# Altium project Oximeter_Board.PrjPcb
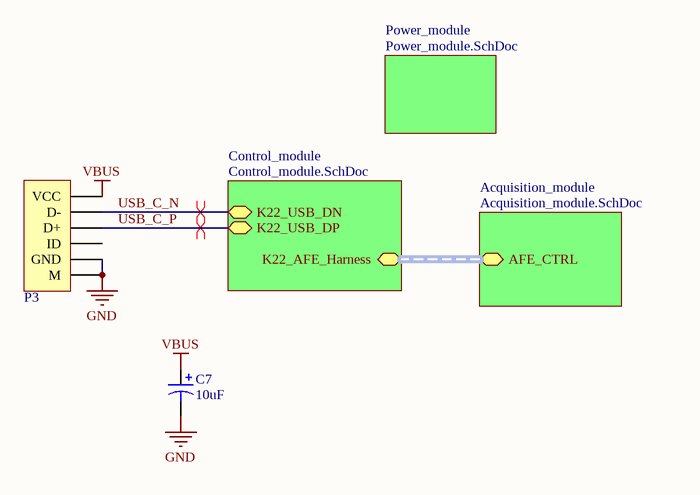
[diagram p0: Main.SchDoc]
3 sheets, 40 parts. Net scope: hierarchical (ports join the sheet entries above them; power ports are global).
Board file: PCB.PcbDoc
Sheets:
  Main.SchDoc
    Control_module = Control_module.SchDoc
    Acquisition_module = Acquisition_module.SchDoc

## Sheet Main.SchDoc
size A4

### Parts
C7  value 10uF  [CAP SMD 4mm]  (hidden comment: Cap Pol1)
P3  USB Header  [MicroUSB-B]  (value not drawn)

### Sub-sheets
Acquisition_module = Acquisition_module.SchDoc: AFE_CTRL (harness AFE_Harness)
Control_module = Control_module.SchDoc: K22_AFE_Harness (harness AFE_Harness), K22_USB_DP (bidir), K22_USB_DN (bidir)
Power_module = Power_module.SchDoc (file not in this document): no entries

### Nets
GND: C7.2 P3.GND P3.M
VBUS: C7.1 P3.VCC
USB_C_N: P3.D- ; sheet Control_module/K22_USB_DN
USB_C_P: P3.D+ ; sheet Control_module/K22_USB_DP

Not connected (* = marked no-connect by the designer): P3 ID

### Buses and harness runs
harness sheet Acquisition_module/AFE_CTRL = sheet Control_module/K22_AFE_Harness

### Layout directives
differential pair: USB_C_N, USB_C_P

### Library data of the parts
C7 = Cap Pol1: Polarized Capacitor (Radial); Published: 8-Jun-2000; LatestRevisionDate: 17-Jul-2002; LatestRevisionNote: Re-released for DXP Platform.; PackageReference: RB7.6-15; Publisher: Altium Limited; PackageDescription: Polarized Capacitor (Radial); 2 Leads
P3 = USB 7 pin Header: LatestRevisionDate: 17-Jul-2002; LatestRevisionNote: Re-released for DXP Platform.; Publisher: Altium Limited

## Sheet Control_module.SchDoc
size A4
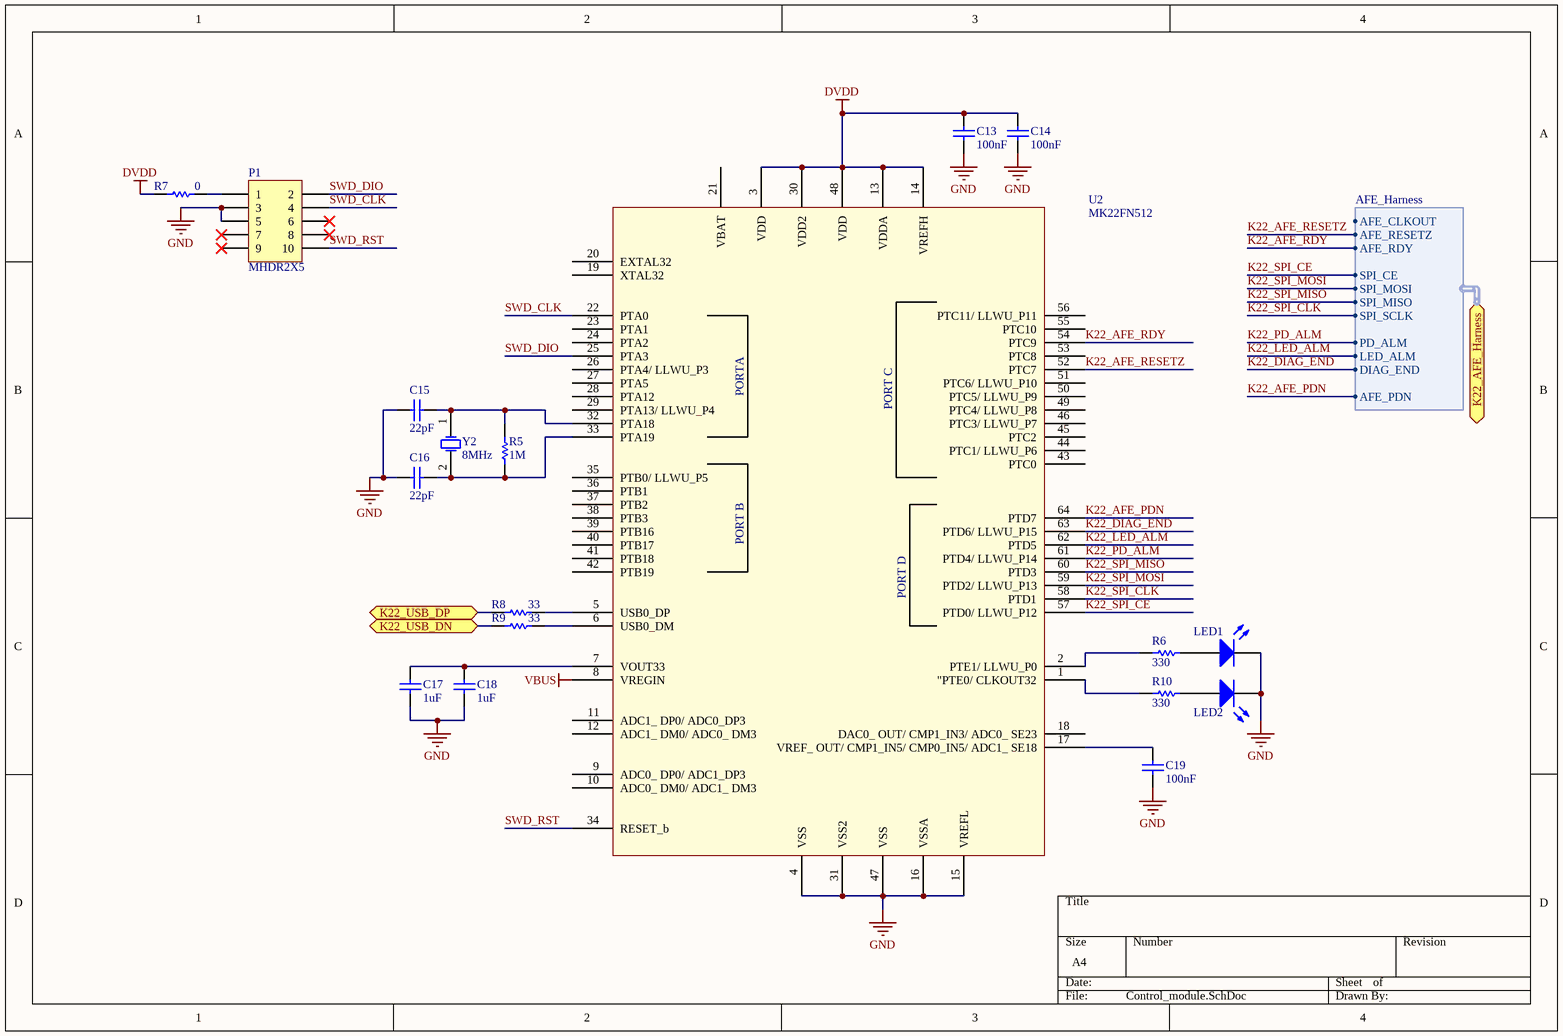
[diagram p1: Control_module.SchDoc]

### Parts
C13  value 100nF  [6-0805_M]  (hidden comment: Cap)
C14  value 100nF  [6-0805_M]  (hidden comment: Cap)
C15  value 22pF  [6-0805_M]  (hidden comment: Cap)
C16  value 22pF  [6-0805_M]  (hidden comment: Cap)
C17  value 1uF  [6-0805_M]  (hidden comment: Cap)
C18  value 1uF  [6-0805_M]  (hidden comment: Cap)
C19  value 100nF  [6-0805_M]  (hidden comment: Cap)
LED1  LED0  [6-0805_M]  (value not drawn)
LED2  LED0  [6-0805_M]  (value not drawn)
P1  MHDR2X5  [MHDR2X5]
R5  value 1M  [6-0805_M]  (hidden comment: Res1)
R6  value 330  [6-0805_M]  (hidden comment: Res1)
R7  value 0  [6-0805_M]  (hidden comment: Res1)
R8  value 33  [6-0805_M]  (hidden comment: Res1)
R9  value 33  [6-0805_M]  (hidden comment: Res1)
R10  value 330  [6-0805_M]  (hidden comment: Res1)
U2  MK22FN512  [MK22FN512_TSQFP50P1200X1200X160-64N]
Y2  8MHz  [Crystal SMD]

### Ports
K22_AFE_Harness (harness AFE_Harness), K22_USB_DN (bidir), K22_USB_DP (bidir)

### Harnesses
AFE_Harness: AFE_CLKOUT, AFE_RESETZ, AFE_RDY, SPI_CE, SPI_MOSI, SPI_MISO, SPI_SCLK, PD_ALM, LED_ALM, DIAG_END, AFE_PDN

### Nets
DVDD: C13.1 C14.1 R7.1 U2.3(VDD) U2.13(VDDA) U2.14(VREFH) U2.30(VDD2) U2.48(VDD)
GND: C13.2 C14.2 C15.1 C16.1 C17.1 C18.1 C19.1 LED1.2(K) LED2.2(K) P1.3 P1.5 U2.4(VSS) U2.15(VREFL) U2.16(VSSA) U2.31(VSS2) U2.47(VSS)
VBUS: U2.8(VREGIN)
K22_AFE_PDN: U2.64(PTD7) ; port K22_AFE_Harness.AFE_PDN  [project net AFE_PDN]
K22_AFE_RDY: U2.54(PTC9) ; port K22_AFE_Harness.AFE_RDY
K22_AFE_RESETZ: U2.52(PTC7) ; port K22_AFE_Harness.AFE_RESETZ
K22_DIAG_END: U2.63(PTD6/_LLWU_P15) ; port K22_AFE_Harness.DIAG_END
K22_LED_ALM: U2.62(PTD5) ; port K22_AFE_Harness.LED_ALM
K22_PD_ALM: U2.61(PTD4/_LLWU_P14) ; port K22_AFE_Harness.PD_ALM
K22_SPI_CE: U2.57(PTD0/_LLWU_P12) ; port K22_AFE_Harness.SPI_CE
K22_SPI_CLK: U2.58(PTD1) ; port K22_AFE_Harness.SPI_SCLK
K22_SPI_MISO: U2.60(PTD3) ; port K22_AFE_Harness.SPI_MISO
K22_SPI_MOSI: U2.59(PTD2/_LLWU_P13) ; port K22_AFE_Harness.SPI_MOSI
SWD_CLK: P1.4 U2.22(PTA0)
SWD_DIO: P1.2 U2.25(PTA3)
SWD_RST: P1.10 U2.34(RESET_b)
USB_C_N: R9.1 ; port K22_USB_DN
USB_C_P: R8.1 ; port K22_USB_DP
NetC15_2: C15.2 R5.1 U2.32(PTA18) Y2.1(OSC1)
NetC16_2: C16.2 R5.2 U2.33(PTA19) Y2.2(OSC2)
NetC17_2: C17.2 C18.2 U2.7(VOUT33)
NetC19_2: C19.2 U2.17(VREF__OUT/_CMP1_IN5/_CMP0_IN5/_ADC1__SE18)
NetLED1_1: LED1.1(A) R6.2
NetLED2_1: LED2.1(A) R10.2
NetP1_1: P1.1 R7.2
NetR6_1: R6.1 U2.2(PTE1/_LLWU_P0)
NetR8_2: R8.2 U2.5(USB0_DP)
NetR9_2: R9.2 U2.6(USB0_DM)
NetR10_1: R10.1 U2.1("PTE0/_CLKOUT32)

Not connected (* = marked no-connect by the designer): P1 6* 7* 8* 9*; U2 9(ADC0__DP0/_ADC1_DP3) 10(ADC0__DM0/_ADC1__DM3) 11(ADC1__DP0/_ADC0_DP3) 12(ADC1__DM0/_ADC0__DM3) 18(DAC0__OUT/_CMP1_IN3/_ADC0__SE23) 19(XTAL32) 20(EXTAL32) 21(VBAT) 23(PTA1) 24(PTA2) 26(PTA4/_LLWU_P3) 27(PTA5) 28(PTA12) 29(PTA13/_LLWU_P4) 35(PTB0/_LLWU_P5) 36(PTB1) 37(PTB2) 38(PTB3) 39(PTB16) 40(PTB17) 41(PTB18) 42(PTB19) 43(PTC0) 44(PTC1/_LLWU_P6) 45(PTC2) 46(PTC3/_LLWU_P7) 49(PTC4/_LLWU_P8) 50(PTC5/_LLWU_P9) 51(PTC6/_LLWU_P10) 53(PTC8) 55(PTC10) 56(PTC11/_LLWU_P11)

### Notes on the sheet
- (in symbol MK22FN512) PORTA; PORT C; PORT B; PORT D

### Library data of the parts
C13-C19 = Cap: Capacitor; Published: 8-Jun-2000; LatestRevisionDate: 17-Jul-2002; LatestRevisionNote: Re-released for DXP Platform.; PackageReference: RAD-0.3; Publisher: Altium Limited; PackageDescription: Radial Cap, Thru-Hole; 2 Leads; 0.3 in Pin Spacing
LED1 LED2 = LED0: Typical INFRARED GaAs LED; Published: 8-Jun-2000; LatestRevisionDate: 08-Jul-2005; LatestRevisionNote: Mech Layer 1 removed.; PackageReference: LED-0; Publisher: Altium Limited; PackageDescription: LED; 2 Leads
P1 = MHDR2X5: Header, 5-Pin, Dual row; LatestRevisionDate: 17-Jul-2002; LatestRevisionNote: Re-released for DXP Platform.; Publisher: Altium Limited
R5-R10 = Res1: Resistor; Published: 8-Jun-2000; LatestRevisionDate: 17-Jul-2002; LatestRevisionNote: Re-released for DXP Platform.; PackageReference: AXIAL-0.3; Publisher: Altium Limited; PackageDescription: Axial Device, Thru-Hole; 2 Leads; 0.3 in Pin Spacing
U2 = MK22FN512: 120 MHz Cortex-M4 Based Microcontroller with FPU
Y2 = XTAL: Crystal Oscillator; Published: 8-Jun-2000; LatestRevisionDate: 17-Jul-2002; LatestRevisionNote: Re-released for DXP Platform.; PackageReference: R38; Publisher: Altium Limited; PackageDescription: Crystal, Thru-Hole; 2 Leads; Body 3.1 x 8.2 mm (Dia.xH)

## Sheet Acquisition_module.SchDoc
size A4
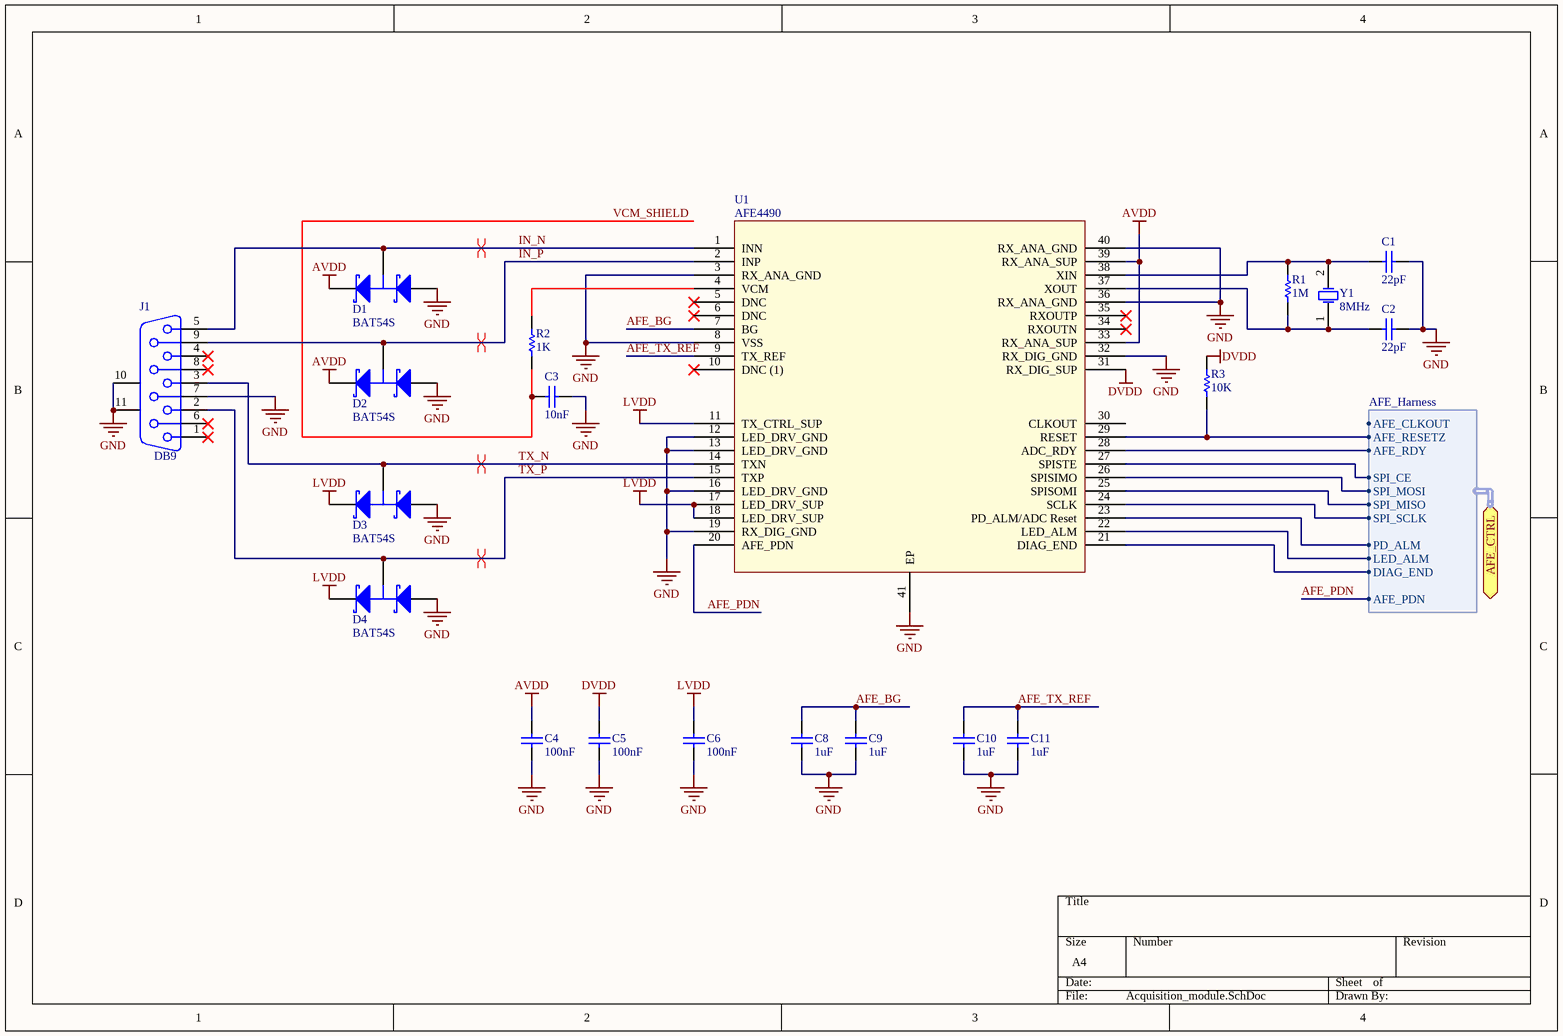
[diagram p2: Acquisition_module.SchDoc]

### Parts
C1  value 22pF  [6-0805_M]  (hidden comment: Cap)
C2  value 22pF  [6-0805_M]  (hidden comment: Cap)
C3  value 10nF  [6-0805_M]  (hidden comment: Cap)
C4  value 100nF  [6-0805_M]  (hidden comment: Cap)
C5  value 100nF  [6-0805_M]  (hidden comment: Cap)
C6  value 100nF  [6-0805_M]  (hidden comment: Cap)
C8  value 1uF  [6-0805_M]  (hidden comment: Cap)
C9  value 1uF  [6-0805_M]  (hidden comment: Cap)
C10  value 1uF  [6-0805_M]  (hidden comment: Cap)
C11  value 1uF  [6-0805_M]  (hidden comment: Cap)
D1  BAT54S  [SOT23_N]
D2  BAT54S  [SOT23_N]
D3  BAT54S  [SOT23_N]
D4  BAT54S  [SOT23_N]
J1  DB9  [DB9]
R1  value 1M  [6-0805_M]  (hidden comment: Res1)
R2  value 1K  [6-0805_M]  (hidden comment: Res1)
R3  value 10K  [6-0805_M]  (hidden comment: Res1)
U1  AFE4490  [AFE4490QFN50P680X680X100_HS-41N]
Y1  8MHz  [Crystal SMD]

### Ports
AFE_CTRL (harness AFE_Harness)

### Harnesses
AFE_Harness: AFE_CLKOUT, AFE_RESETZ, AFE_RDY, SPI_CE, SPI_MOSI, SPI_MISO, SPI_SCLK, PD_ALM, LED_ALM, DIAG_END, AFE_PDN

### Nets
AVDD: C4.2 D1.2(K) D2.2(K) U1.33(RX_ANA_SUP) U1.39(RX_ANA_SUP)
DVDD: C5.2 R3.2 U1.31(RX_DIG_SUP)
GND: C1.1 C2.1 C3.1 C4.1 C5.1 C6.1 C8.1 C9.1 C10.1 C11.1 D1.1(A) D2.1(A) D3.1(A) D4.1(A) J1.7 J1.10(MH1) J1.11(MH2) U1.3(RX_ANA_GND) U1.8(VSS) U1.12(LED_DRV_GND) U1.13(LED_DRV_GND) U1.16(LED_DRV_GND) U1.19(RX_DIG_GND) U1.32(RX_DIG_GND) U1.36(RX_ANA_GND) U1.40(RX_ANA_GND) U1.41(EP)
LVDD: C6.2 D3.2(K) D4.2(K) U1.11(TX_CTRL_SUP) U1.17(LED_DRV_SUP) U1.18(LED_DRV_SUP)
AFE_BG: C8.2 C9.2 U1.7(BG)
AFE_PDN: U1.20(AFE_PDN) ; port AFE_CTRL.AFE_PDN
AFE_TX_REF: C10.2 C11.2 U1.9(TX_REF)
IN_N: D1.3(C) J1.5 U1.1(INN)
IN_P: D2.3(C) J1.9 U1.2(INP)
K22_AFE_RDY: U1.28(ADC_RDY) ; port AFE_CTRL.AFE_RDY
K22_AFE_RESETZ: R3.1 U1.29(RESET) ; port AFE_CTRL.AFE_RESETZ
K22_DIAG_END: U1.21(DIAG_END) ; port AFE_CTRL.DIAG_END
K22_LED_ALM: U1.22(LED_ALM) ; port AFE_CTRL.LED_ALM
K22_PD_ALM: U1.23(PD_ALM/ADC_Reset) ; port AFE_CTRL.PD_ALM
K22_SPI_CE: U1.27(SPISTE) ; port AFE_CTRL.SPI_CE
K22_SPI_CLK: U1.24(SCLK) ; port AFE_CTRL.SPI_SCLK
K22_SPI_MISO: U1.25(SPISOMI) ; port AFE_CTRL.SPI_MISO
K22_SPI_MOSI: U1.26(SPISIMO) ; port AFE_CTRL.SPI_MOSI
TX_N: D3.3(C) J1.3 U1.14(TXN)
TX_P: D4.3(C) J1.2 U1.15(TXP)
VCM_SHIELD: C3.2 R2.1
NetC1_2: C1.2 R1.1 U1.38(XIN) Y1.2(OSC2)
NetC2_2: C2.2 R1.2 U1.37(XOUT) Y1.1(OSC1)
NetR2_2: R2.2 U1.4(VCM)

Not connected (* = marked no-connect by the designer): J1 1* 4* 6* 8*; U1 5(DNC)* 6(DNC)* 10(DNC_(1))* 30(CLKOUT) 34(RXOUTN)* 35(RXOUTP)*

### Layout directives
differential pair: IN_N, IN_P, TX_N, TX_P

### Library data of the parts
C1-C6 C8-C11 = Cap: Capacitor; Published: 8-Jun-2000; LatestRevisionDate: 17-Jul-2002; LatestRevisionNote: Re-released for DXP Platform.; PackageReference: RAD-0.3; Publisher: Altium Limited; PackageDescription: Radial Cap, Thru-Hole; 2 Leads; 0.3 in Pin Spacing
D1-D4 = BAT54S: Schottky Barrier Double Diode; Published: 17-Sep-2003; LatestRevisionDate: 12-Dec-2006; LatestRevisionNote: IPC-7351 Footprint Added.; DatasheetVersion: 4-Mar-2002; PackageVersion: May-1999; PackageReference: SOT23; Publisher: Altium Limited; PackageDescription: 3-Pin SOT-23 Package 0.95 mm Pitch, 2.3 mm Lead Span; ComponentLink1Description: Manufacturer Link; ComponentLink1URL: http://www.semiconductors.philips.com/; ComponentLink2Description: Datasheet; ComponentLink2URL: http://www.semiconductors.philips.com/acrobat/datasheets/BAT54_SERIES_4.pdf
J1 = D Connector 9: Receptacle Assembly, 9 Position, Right Angle; PackageDocument: O; Positions: 9; Published: 15-Jun-2001; LatestRevisionDate: 17-Jul-2002; LatestRevisionNote: Re-released for DXP Platform.; DatasheetDocument: 1-Sep-1999; PackageReference: 788750; Publisher: Altium Limited; Orientation: Right Angle; Gender: Receptacle
R1-R3 = Res1: Resistor; Published: 8-Jun-2000; LatestRevisionDate: 17-Jul-2002; LatestRevisionNote: Re-released for DXP Platform.; PackageReference: AXIAL-0.3; Publisher: Altium Limited; PackageDescription: Axial Device, Thru-Hole; 2 Leads; 0.3 in Pin Spacing
U1 = AFE4490: Integrated Analog Front-End for Pulse Oximeters
Y1 = XTAL: Crystal Oscillator; Published: 8-Jun-2000; LatestRevisionDate: 17-Jul-2002; LatestRevisionNote: Re-released for DXP Platform.; PackageReference: R38; Publisher: Altium Limited; PackageDescription: Crystal, Thru-Hole; 2 Leads; Body 3.1 x 8.2 mm (Dia.xH)

## Nets that join several sheets
DVDD: Control_module (8 pins), Acquisition_module (C5.2 R3.2 U1.31)
GND: Main (C7.2 P3.GND P3.M), Control_module (16 pins), Acquisition_module (27 pins)
VBUS: Main (C7.1 P3.VCC), Control_module (U2.8)
AFE_PDN: Control_module (U2.64), Acquisition_module (U1.20)
K22_AFE_RDY: Control_module (U2.54), Acquisition_module (U1.28)
K22_AFE_RESETZ: Control_module (U2.52), Acquisition_module (R3.1 U1.29)
K22_DIAG_END: Control_module (U2.63), Acquisition_module (U1.21)
K22_LED_ALM: Control_module (U2.62), Acquisition_module (U1.22)
K22_PD_ALM: Control_module (U2.61), Acquisition_module (U1.23)
K22_SPI_CE: Control_module (U2.57), Acquisition_module (U1.27)
K22_SPI_CLK: Control_module (U2.58), Acquisition_module (U1.24)
K22_SPI_MISO: Control_module (U2.60), Acquisition_module (U1.25)
K22_SPI_MOSI: Control_module (U2.59), Acquisition_module (U1.26)
USB_C_N: Main (P3.D-), Control_module (R9.1)
USB_C_P: Main (P3.D+), Control_module (R8.1)